# Altium schematic sheet PocketAnalyzer_SwtBoardB_R00.SchDoc
size A4; SheetNumber: 3; SheetTotal: 3
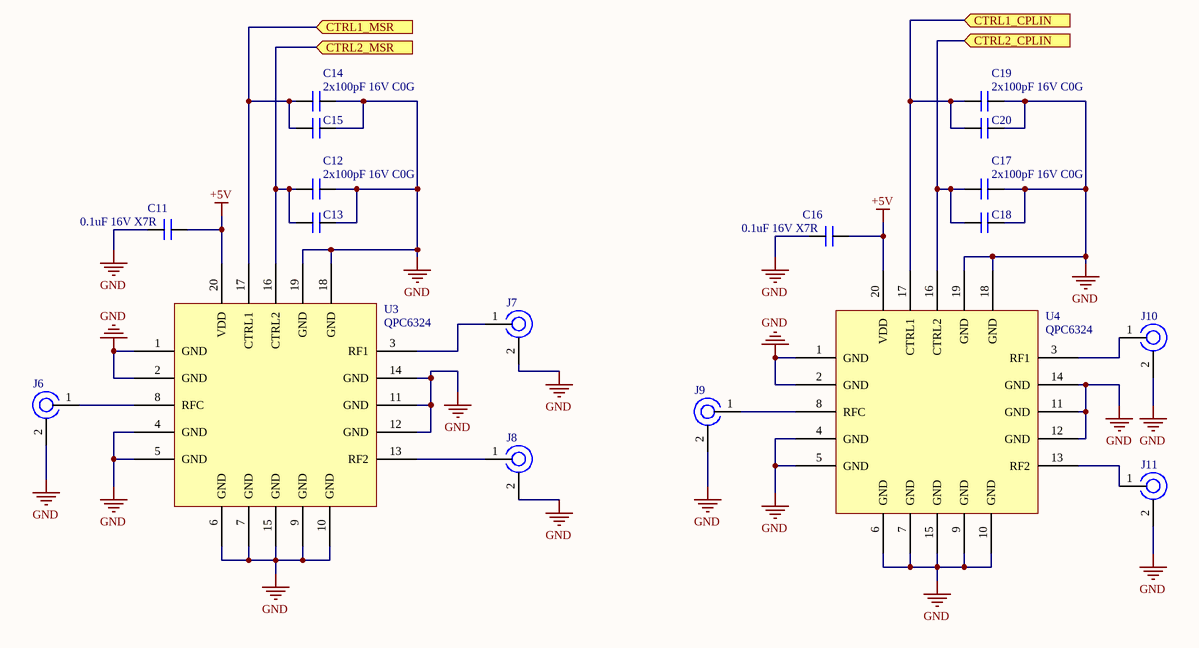
[diagram p0: PocketAnalyzer_SwtBoardB_R00.SchDoc]

## Parts
C11  0.1uF 16V X7R  [C_0805]
C12  2x100pF 16V C0G  [C_0805]
C13  200pF 16V C0G  [C_0805]  (value not drawn)
C14  200pF 16V C0G  [C_0805]  (value not drawn)
C15  2x100pF 16V C0G  [C_0805]
C16  0.1uF 16V X7R  [C_0805]
C17  2x100pF 16V C0G  [C_0805]
C18  200pF 16V C0G  [C_0805]  (value not drawn)
C19  2x100pF 16V C0G  [C_0805]
C20  200pF 16V C0G  [C_0805]  (value not drawn)
J6  SMA_Connector  [SMA_Connector]  (value not drawn)
J7  SMA_Connector  [SMA_Connector]  (value not drawn)
J8  SMA_Connector  [SMA_Connector]  (value not drawn)
J9  SMA_Connector  [SMA_Connector]  (value not drawn)
J10  SMA_Connector  [SMA_Connector]  (value not drawn)
J11  SMA_Connector  [SMA_Connector]  (value not drawn)
U3  QPC6324  [QFN50P400X400X90-21N-D]
U4  QPC6324  [QFN50P400X400X90-21N-D]

## Ports
CTRL1_CPLIN (in), CTRL1_MSR (in), CTRL2_CPLIN (in), CTRL2_MSR (in)

## Nets
+5V: C11.2 C16.2 U3.20(VDD) U4.20(VDD)
GND: C11.1 C12.2 C13.2 C14.2 C15.2 C16.1 C17.2 C18.2 C19.2 C20.2 J6.2 J7.2 J8.2 J9.2 J10.2 J11.2 U3.1(GND) U3.2(GND) U3.4(GND) U3.5(GND) U3.6(GND) U3.7(GND) U3.9(GND) U3.10(GND) U3.11(GND) U3.12(GND) U3.14(GND) U3.15(GND) U3.18(GND) U3.19(GND) U4.1(GND) U4.2(GND) U4.4(GND) U4.5(GND) U4.6(GND) U4.7(GND) U4.9(GND) U4.10(GND) U4.11(GND) U4.12(GND) U4.14(GND) U4.15(GND) U4.18(GND) U4.19(GND)
CTRL1_CPLIN: C19.1 C20.1 U4.17(CTRL1) ; port CTRL1_CPLIN
CTRL1_MSR: C14.1 C15.1 U3.17(CTRL1) ; port CTRL1_MSR
CTRL2_CPLIN: C17.1 C18.1 U4.16(CTRL2) ; port CTRL2_CPLIN
CTRL2_MSR: C12.1 C13.1 U3.16(CTRL2) ; port CTRL2_MSR
NetJ6_1: J6.1 U3.8(RFC)
NetJ7_1: J7.1 U3.3(RF1)
NetJ8_1: J8.1 U3.13(RF2)
NetJ9_1: J9.1 U4.8(RFC)
NetJ10_1: J10.1 U4.3(RF1)
NetJ11_1: J11.1 U4.13(RF2)

## Library data of the parts
C11-C20 = Ceramic Cap
J6-J11 = SMA_Connector: Connector SMA
U3 U4 = QPC6324: SPDT RF Switch